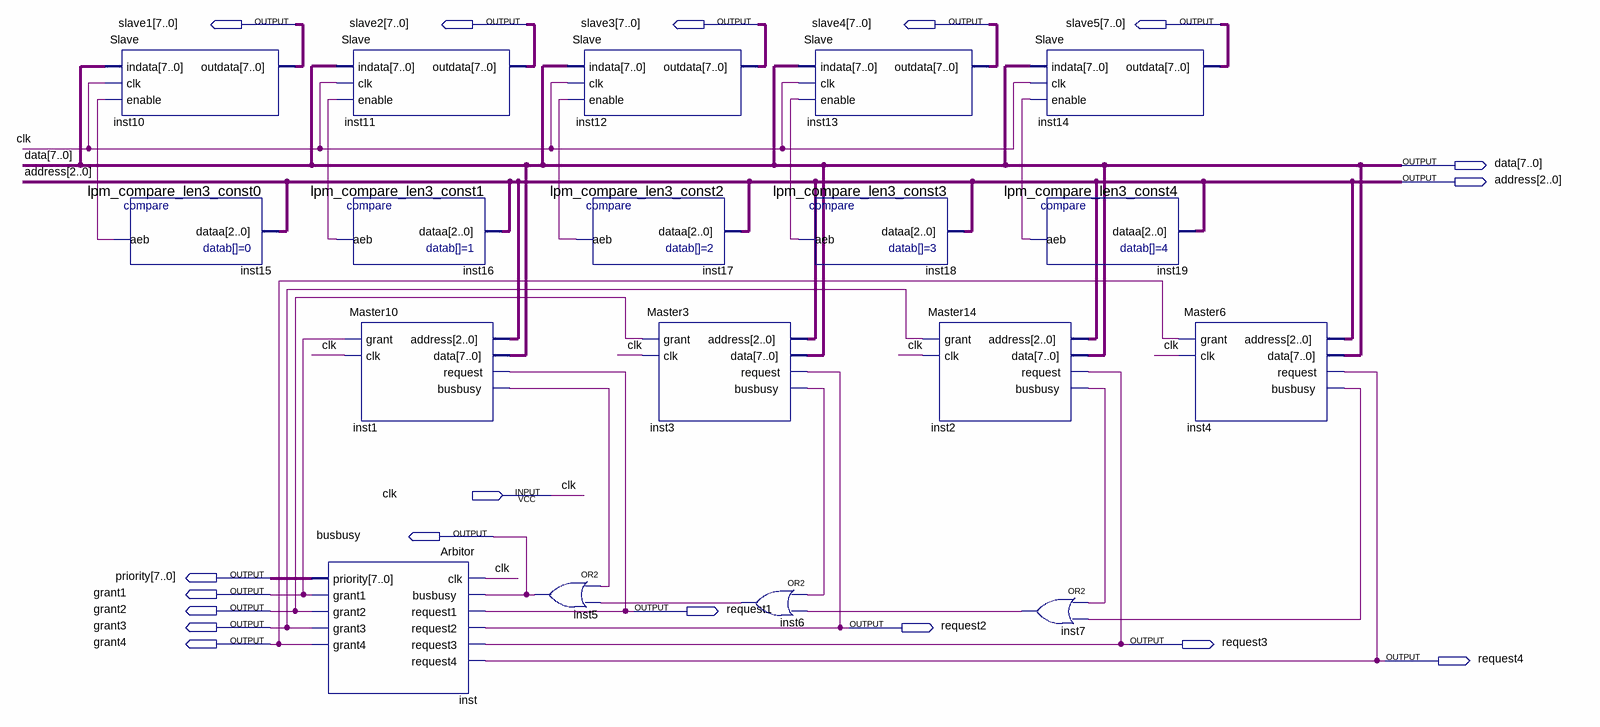
[diagram p0: schematic sheet]
// Quartus schematic Lab7.bdf as structural Verilog: 18 symbols, 18 pins
module Lab7 (
  input  clk,
  output [7:0] slave1,
  output [7:0] slave2,
  output [7:0] slave3,
  output [7:0] slave4,
  output [7:0] slave5,
  output [7:0] data,
  output [2:0] address,
  output busbusy,
  output [7:0] \priority ,
  output grant1,
  output grant2,
  output request1,
  output grant3,
  output request2,
  output grant4,
  output request3,
  output request4
);

  wire inst1_busbusy, inst2_busbusy, inst3_busbusy, inst4_busbusy, inst6_out, inst7_out, inst15_aeb,
       inst16_aeb, inst17_aeb, inst18_aeb, inst19_aeb;

  Slave inst10 (.indata(data), .clk(clk), .enable(inst15_aeb), .outdata(slave1));
  lpm_compare_len3_const0 inst15 (.dataa(address), .aeb(inst15_aeb));
  Slave inst11 (.indata(data), .clk(clk), .enable(inst16_aeb), .outdata(slave2));
  lpm_compare_len3_const1 inst16 (.dataa(address), .aeb(inst16_aeb));
  Master10 inst1 (
    .grant(grant1), .clk(clk), .address(address), .data(data), .request(request1), .busbusy(inst1_busbusy));
  Arbitor inst (
    .clk(clk), .busbusy(busbusy), .request1(request1), .request2(request2), .request3(request3),
    .request4(request4), .\priority (\priority ), .grant1(grant1), .grant2(grant2), .grant3(grant3),
    .grant4(grant4));
  Slave inst12 (.indata(data), .clk(clk), .enable(inst17_aeb), .outdata(slave3));
  or inst5 (busbusy, inst1_busbusy, inst6_out);
  lpm_compare_len3_const2 inst17 (.dataa(address), .aeb(inst17_aeb));
  Master3 inst3 (
    .grant(grant2), .clk(clk), .address(address), .data(data), .request(request2), .busbusy(inst3_busbusy));
  or inst6 (inst6_out, inst3_busbusy, inst7_out);
  Slave inst13 (.indata(data), .clk(clk), .enable(inst18_aeb), .outdata(slave4));
  lpm_compare_len3_const3 inst18 (.dataa(address), .aeb(inst18_aeb));
  Master14 inst2 (
    .grant(grant3), .clk(clk), .address(address), .data(data), .request(request3), .busbusy(inst2_busbusy));
  Slave inst14 (.indata(data), .clk(clk), .enable(inst19_aeb), .outdata(slave5));
  lpm_compare_len3_const4 inst19 (.dataa(address), .aeb(inst19_aeb));
  or inst7 (inst7_out, inst2_busbusy, inst4_busbusy);
  Master6 inst4 (
    .grant(grant4), .clk(clk), .address(address), .data(data), .request(request4), .busbusy(inst4_busbusy));
endmodule
